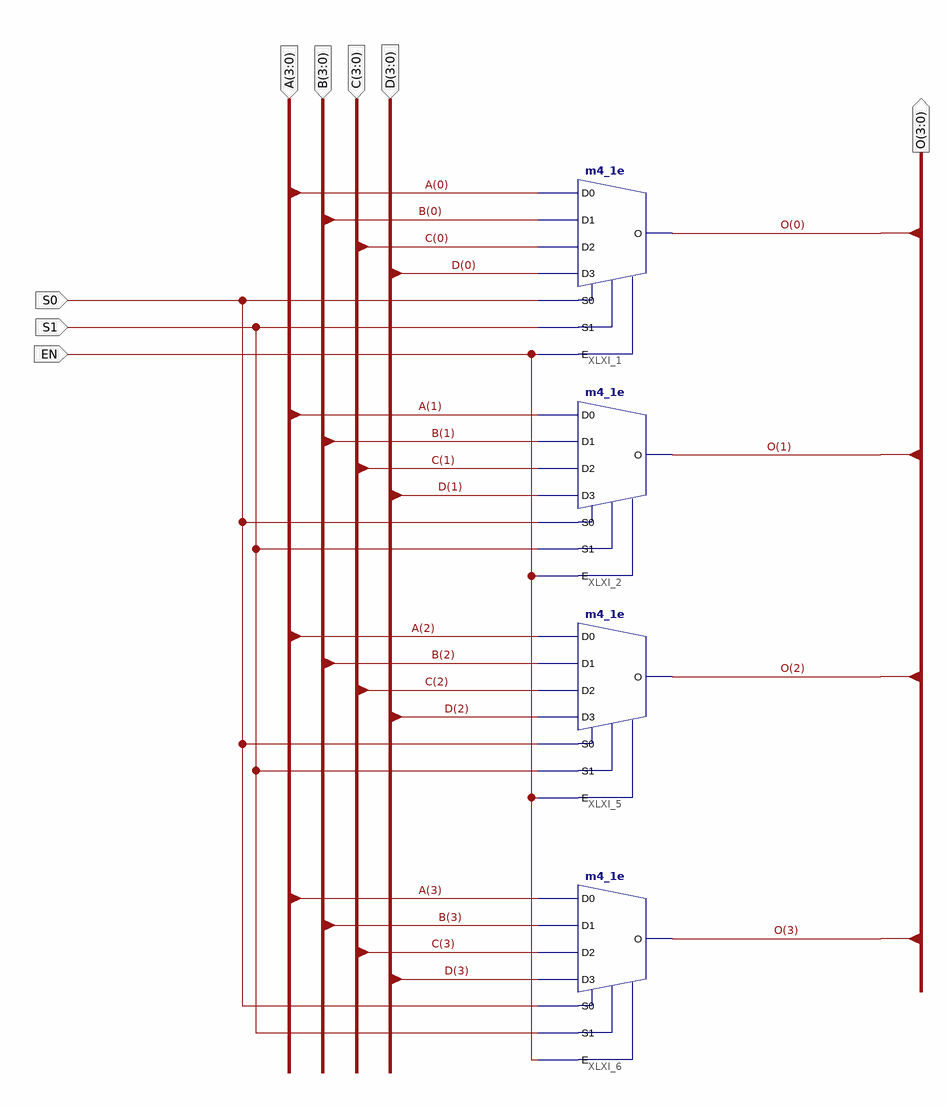
[diagram p0: schematic sheet 1]
// Xilinx ISE schematic my_mux4_4to1.sch (virtex6) as structural Verilog: 4 symbols, 8 ports
module my_mux4_4to1 (
  input  S1,
  input  EN,
  input  S0,
  input  [3:0] A,
  input  [3:0] B,
  input  [3:0] D,
  input  [3:0] C,
  output [3:0] O
);

  m4_1e XLXI_1 (.D0(A[0]), .D1(B[0]), .D2(C[0]), .D3(D[0]), .E(EN), .S0(S0), .S1(S1), .O(O[0]));
  m4_1e XLXI_2 (.D0(A[1]), .D1(B[1]), .D2(C[1]), .D3(D[1]), .E(EN), .S0(S0), .S1(S1), .O(O[1]));
  m4_1e XLXI_5 (.D0(A[2]), .D1(B[2]), .D2(C[2]), .D3(D[2]), .E(EN), .S0(S0), .S1(S1), .O(O[2]));
  m4_1e XLXI_6 (.D0(A[3]), .D1(B[3]), .D2(C[3]), .D3(D[3]), .E(EN), .S0(S0), .S1(S1), .O(O[3]));
endmodule
